# Altium project HOUZZkitF1_Tester_2nd.PrjPcb
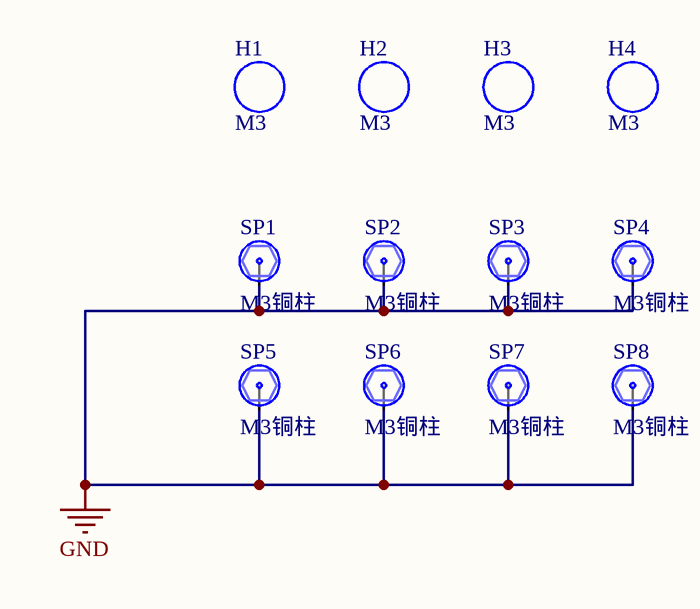
[diagram p0: HOUZZkitF1_Tester_2nd.SchDoc]
1 sheet, 12 parts. Net scope: global (net labels, ports and power ports of the same name join across sheets).
Board file: HOUZZkitF1_Tester_2nd.PcbDoc

## Sheet HOUZZkitF1_Tester_2nd.SchDoc
size A3; SheetNumber: 1; SheetTotal: 1

### Parts
H1  M3  [M3 125X200]
H2  M3  [M3 125X200]
H3  M3  [M3 125X200]
H4  M3  [M3 125X200]
SP1  M3铜柱  [M3x4_N]
SP2  M3铜柱  [M3x4_N]
SP3  M3铜柱  [M3x4_N]
SP4  M3铜柱  [M3x4_N]
SP5  M3铜柱  [M3x4_N]
SP6  M3铜柱  [M3x4_N]
SP7  M3铜柱  [M3x4_N]
SP8  M3铜柱  [M3x4_N]

### Nets
GND: SP1.1 SP2.1 SP3.1 SP4.1 SP5.1 SP6.1 SP7.1 SP8.1

### Library data of the parts
H1-H4 = M3: 铜柱孔; 版权归属: 源创客; BOM名称: 铜柱孔; 学习资源: www.ooocke.com
SP1-SP8 = 铜柱大焊盘: 铜柱; 版权归属: 源创客; BOM名称: 铜柱; 学习资源: www.ooocke.com